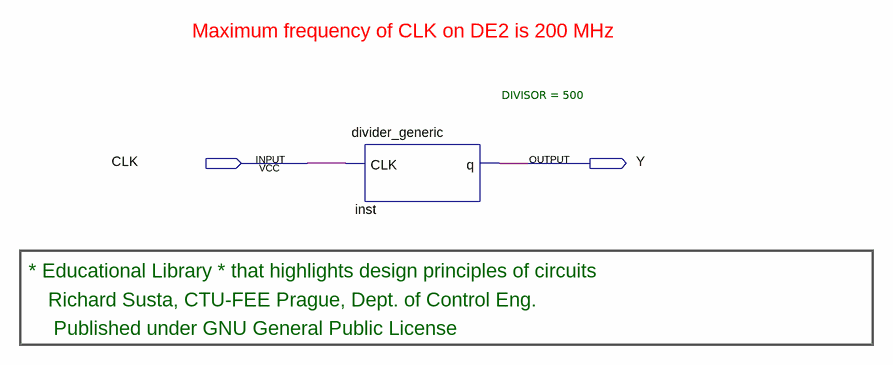
[diagram p0: schematic sheet]
// Quartus schematic divider500.bdf as structural Verilog: 1 symbols, 2 pins
module divider500 (
  input  CLK,
  output Y
);

  divider_generic #(.DIVISOR(500)) inst (.CLK(CLK), .q(Y));

  // Notes on the sheet:
  //   Maximum frequency of CLK on DE2 is 200 MHz
  //   * Educational Library * that highlights design principles of circuits
  //   Richard Susta, CTU-FEE Prague, Dept. of Control Eng. 
  //    Published under GNU General Public License
endmodule
